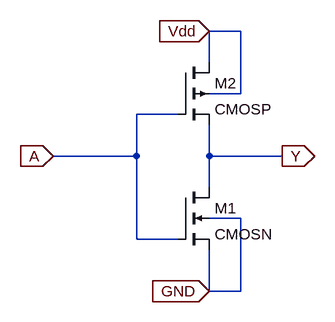
[diagram p0: schematic inverter_cmos.asc]
inverter_cmos.asc, the LTspice schematic file:
Version 4
SHEET 1 880 680
WIRE 304 -16 256 -16
WIRE 256 32 256 -16
WIRE 304 80 304 -16
WIRE 304 80 256 80
WIRE 208 112 144 112
WIRE 144 176 144 112
WIRE 144 176 16 176
WIRE 256 176 256 128
WIRE 368 176 256 176
WIRE 256 224 256 176
WIRE 304 272 256 272
WIRE 144 304 144 176
WIRE 208 304 144 304
WIRE 256 384 256 320
WIRE 304 384 304 272
WIRE 304 384 256 384
FLAG 368 176 Y
IOPIN 368 176 Out
FLAG 16 176 A
IOPIN 16 176 In
FLAG 256 -16 Vdd
IOPIN 256 -16 In
FLAG 256 384 GND
IOPIN 256 384 In
SYMBOL cmosn 208 224 R0
SYMATTR InstName M1
SYMATTR Value2 l=180n w=1u
SYMBOL cmosp 208 32 R0
SYMATTR InstName M2
SYMATTR Value2 l=180n w=1u

The netlist it stands for:
* inverter_cmos.asc
M1 Y A GND GND CMOSN l=180n w=1u
M2 Vdd A Y Vdd CMOSP l=180n w=1u
.model NMOS NMOS
.model PMOS PMOS
.lib standard.mos
.backanno
.end